# EAGLE schematic mosfet_ctl (EAGLE 9.6.0)

## Sheet 1 of 3
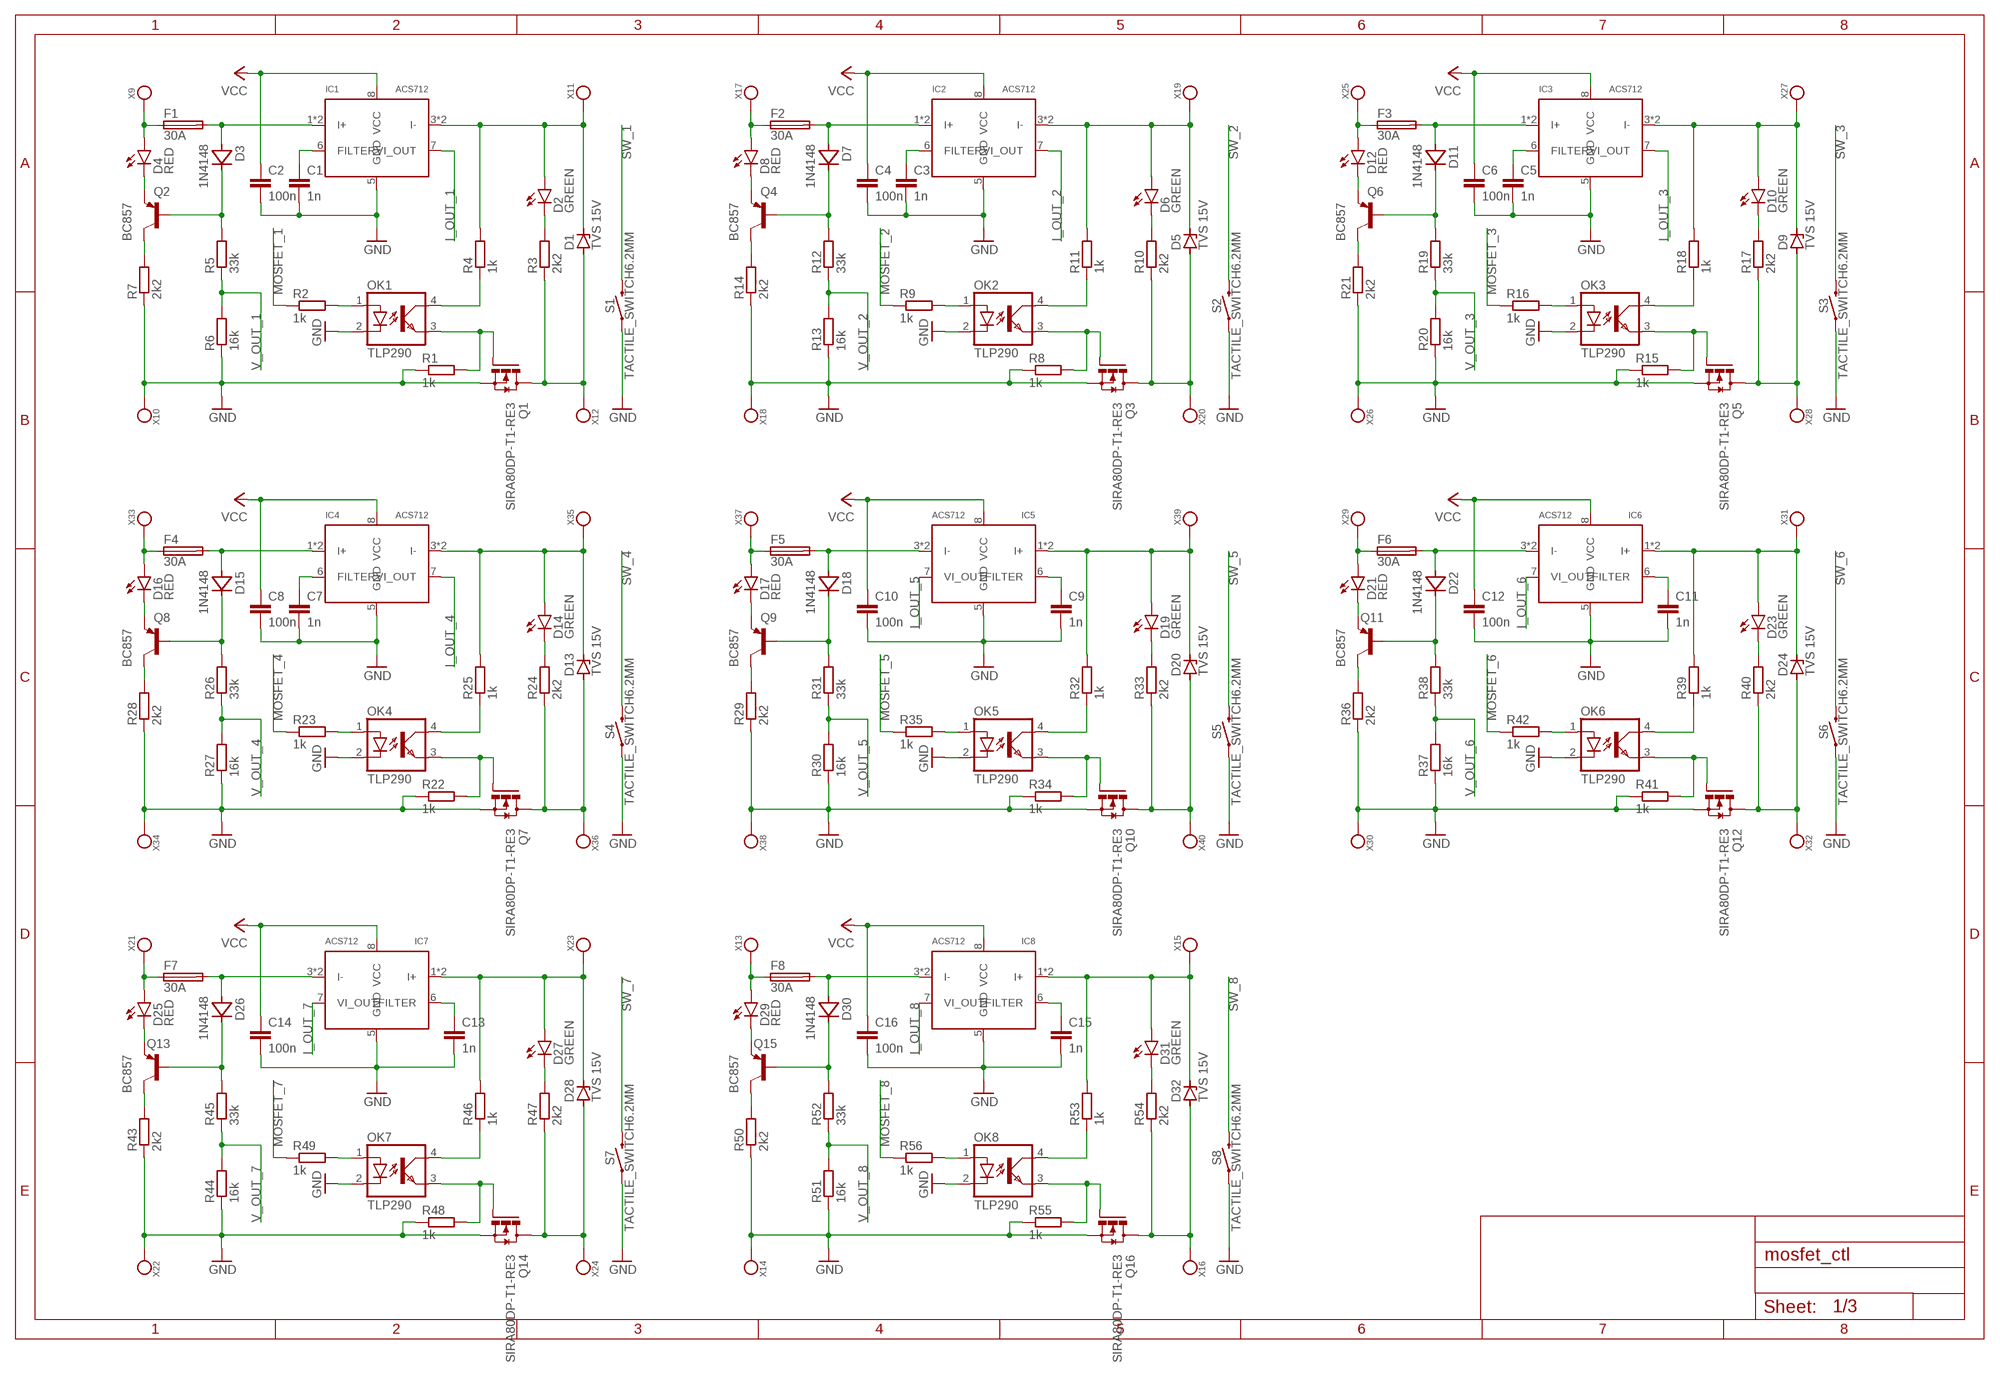
[diagram p0: schematic, sheet 1]

### Parts
C1  1n  CAPACITOR0805  [C0805]
C2  100n  CAPACITOR0805  [C0805]
C3  1n  CAPACITOR0805  [C0805]
C4  100n  CAPACITOR0805  [C0805]
C5  1n  CAPACITOR0805  [C0805]
C6  100n  CAPACITOR0805  [C0805]
C7  1n  CAPACITOR0805  [C0805]
C8  100n  CAPACITOR0805  [C0805]
C9  1n  CAPACITOR0805  [C0805]
C10  100n  CAPACITOR0805  [C0805]
C11  1n  CAPACITOR0805  [C0805]
C12  100n  CAPACITOR0805  [C0805]
C13  1n  CAPACITOR0805  [C0805]
C14  100n  CAPACITOR0805  [C0805]
C15  1n  CAPACITOR0805  [C0805]
C16  100n  CAPACITOR0805  [C0805]
D1  TVS 15V  DIODE_ZENERDO-214AC  [DO214AC]
D2  GREEN  LED1206  [CHIPLED_1206]
D3  1N4148  DIODESOD-123  [SOD123]
D4  RED  LED1206  [CHIPLED_1206]
D5  TVS 15V  DIODE_ZENERDO-214AC  [DO214AC]
D6  GREEN  LED1206  [CHIPLED_1206]
D7  1N4148  DIODESOD-123  [SOD123]
D8  RED  LED1206  [CHIPLED_1206]
D9  TVS 15V  DIODE_ZENERDO-214AC  [DO214AC]
D10  GREEN  LED1206  [CHIPLED_1206]
D11  1N4148  DIODESOD-123  [SOD123]
D12  RED  LED1206  [CHIPLED_1206]
D13  TVS 15V  DIODE_ZENERDO-214AC  [DO214AC]
D14  GREEN  LED1206  [CHIPLED_1206]
D15  1N4148  DIODESOD-123  [SOD123]
D16  RED  LED1206  [CHIPLED_1206]
D17  RED  LED1206  [CHIPLED_1206]
D18  1N4148  DIODESOD-123  [SOD123]
D19  GREEN  LED1206  [CHIPLED_1206]
D20  TVS 15V  DIODE_ZENERDO-214AC  [DO214AC]
D21  RED  LED1206  [CHIPLED_1206]
D22  1N4148  DIODESOD-123  [SOD123]
D23  GREEN  LED1206  [CHIPLED_1206]
D24  TVS 15V  DIODE_ZENERDO-214AC  [DO214AC]
D25  RED  LED1206  [CHIPLED_1206]
D26  1N4148  DIODESOD-123  [SOD123]
D27  GREEN  LED1206  [CHIPLED_1206]
D28  TVS 15V  DIODE_ZENERDO-214AC  [DO214AC]
D29  RED  LED1206  [CHIPLED_1206]
D30  1N4148  DIODESOD-123  [SOD123]
D31  GREEN  LED1206  [CHIPLED_1206]
D32  TVS 15V  DIODE_ZENERDO-214AC  [DO214AC]
F1  30A  KEYSTONE-3557-2  [KEYSTONE_3557-2]
F2  30A  KEYSTONE-3557-2  [KEYSTONE_3557-2]
F3  30A  KEYSTONE-3557-2  [KEYSTONE_3557-2]
F4  30A  KEYSTONE-3557-2  [KEYSTONE_3557-2]
F5  30A  KEYSTONE-3557-2  [KEYSTONE_3557-2]
F6  30A  KEYSTONE-3557-2  [KEYSTONE_3557-2]
F7  30A  KEYSTONE-3557-2  [KEYSTONE_3557-2]
F8  30A  KEYSTONE-3557-2  [KEYSTONE_3557-2]
IC1  ACS712  [SO08]
IC2  ACS712  [SO08]
IC3  ACS712  [SO08]
IC4  ACS712  [SO08]
IC5  ACS712  [SO08]
IC6  ACS712  [SO08]
IC7  ACS712  [SO08]
IC8  ACS712  [SO08]
OK1  TLP290  OPTOCOUPLERSO4  [SO04]
OK2  TLP290  OPTOCOUPLERSO4  [SO04]
OK3  TLP290  OPTOCOUPLERSO4  [SO04]
OK4  TLP290  OPTOCOUPLERSO4  [SO04]
OK5  TLP290  OPTOCOUPLERSO4  [SO04]
OK6  TLP290  OPTOCOUPLERSO4  [SO04]
OK7  TLP290  OPTOCOUPLERSO4  [SO04]
OK8  TLP290  OPTOCOUPLERSO4  [SO04]
Q1  SIRA80DP-T1-RE3  MOSFET_N_CHANNELPPAKSO8  [POWERPAK-SO8]
Q2  BC857  TRANSISTOR_PNPSOT23-CBE  [SOT23]
Q3  SIRA80DP-T1-RE3  MOSFET_N_CHANNELPPAKSO8  [POWERPAK-SO8]
Q4  BC857  TRANSISTOR_PNPSOT23-CBE  [SOT23]
Q5  SIRA80DP-T1-RE3  MOSFET_N_CHANNELPPAKSO8  [POWERPAK-SO8]
Q6  BC857  TRANSISTOR_PNPSOT23-CBE  [SOT23]
Q7  SIRA80DP-T1-RE3  MOSFET_N_CHANNELPPAKSO8  [POWERPAK-SO8]
Q8  BC857  TRANSISTOR_PNPSOT23-CBE  [SOT23]
Q9  BC857  TRANSISTOR_PNPSOT23-CBE  [SOT23]
Q10  SIRA80DP-T1-RE3  MOSFET_N_CHANNELPPAKSO8  [POWERPAK-SO8]
Q11  BC857  TRANSISTOR_PNPSOT23-CBE  [SOT23]
Q12  SIRA80DP-T1-RE3  MOSFET_N_CHANNELPPAKSO8  [POWERPAK-SO8]
Q13  BC857  TRANSISTOR_PNPSOT23-CBE  [SOT23]
Q14  SIRA80DP-T1-RE3  MOSFET_N_CHANNELPPAKSO8  [POWERPAK-SO8]
Q15  BC857  TRANSISTOR_PNPSOT23-CBE  [SOT23]
Q16  SIRA80DP-T1-RE3  MOSFET_N_CHANNELPPAKSO8  [POWERPAK-SO8]
R1  1k  RESISTOR0805  [R0805]
R2  1k  RESISTOR0805  [R0805]
R3  2k2  RESISTOR0805  [R0805]
R4  1k  RESISTOR0805  [R0805]
R5  33k  RESISTOR0805  [R0805]
R6  16k  RESISTOR0805  [R0805]
R7  2k2  RESISTOR0805  [R0805]
R8  1k  RESISTOR0805  [R0805]
R9  1k  RESISTOR0805  [R0805]
R10  2k2  RESISTOR0805  [R0805]
R11  1k  RESISTOR0805  [R0805]
R12  33k  RESISTOR0805  [R0805]
R13  16k  RESISTOR0805  [R0805]
R14  2k2  RESISTOR0805  [R0805]
R15  1k  RESISTOR0805  [R0805]
R16  1k  RESISTOR0805  [R0805]
R17  2k2  RESISTOR0805  [R0805]
R18  1k  RESISTOR0805  [R0805]
R19  33k  RESISTOR0805  [R0805]
R20  16k  RESISTOR0805  [R0805]
R21  2k2  RESISTOR0805  [R0805]
R22  1k  RESISTOR0805  [R0805]
R23  1k  RESISTOR0805  [R0805]
R24  2k2  RESISTOR0805  [R0805]
R25  1k  RESISTOR0805  [R0805]
R26  33k  RESISTOR0805  [R0805]
R27  16k  RESISTOR0805  [R0805]
R28  2k2  RESISTOR0805  [R0805]
R29  2k2  RESISTOR0805  [R0805]
R30  16k  RESISTOR0805  [R0805]
R31  33k  RESISTOR0805  [R0805]
R32  1k  RESISTOR0805  [R0805]
R33  2k2  RESISTOR0805  [R0805]
R34  1k  RESISTOR0805  [R0805]
R35  1k  RESISTOR0805  [R0805]
R36  2k2  RESISTOR0805  [R0805]
R37  16k  RESISTOR0805  [R0805]
R38  33k  RESISTOR0805  [R0805]
R39  1k  RESISTOR0805  [R0805]
R40  2k2  RESISTOR0805  [R0805]
R41  1k  RESISTOR0805  [R0805]
R42  1k  RESISTOR0805  [R0805]
R43  2k2  RESISTOR0805  [R0805]
R44  16k  RESISTOR0805  [R0805]
R45  33k  RESISTOR0805  [R0805]
R46  1k  RESISTOR0805  [R0805]
R47  2k2  RESISTOR0805  [R0805]
R48  1k  RESISTOR0805  [R0805]
R49  1k  RESISTOR0805  [R0805]
R50  2k2  RESISTOR0805  [R0805]
R51  16k  RESISTOR0805  [R0805]
R52  33k  RESISTOR0805  [R0805]
R53  1k  RESISTOR0805  [R0805]
R54  2k2  RESISTOR0805  [R0805]
R55  1k  RESISTOR0805  [R0805]
R56  1k  RESISTOR0805  [R0805]
S1  TACTILE_SWITCH6.2MM  [TACTILE_SWITCH_SMD_6.2MM]
S2  TACTILE_SWITCH6.2MM  [TACTILE_SWITCH_SMD_6.2MM]
S3  TACTILE_SWITCH6.2MM  [TACTILE_SWITCH_SMD_6.2MM]
S4  TACTILE_SWITCH6.2MM  [TACTILE_SWITCH_SMD_6.2MM]
S5  TACTILE_SWITCH6.2MM  [TACTILE_SWITCH_SMD_6.2MM]
S6  TACTILE_SWITCH6.2MM  [TACTILE_SWITCH_SMD_6.2MM]
S7  TACTILE_SWITCH6.2MM  [TACTILE_SWITCH_SMD_6.2MM]
S8  TACTILE_SWITCH6.2MM  [TACTILE_SWITCH_SMD_6.2MM]
X9  KEYSTONE_7800  [KEYSTONE_7800]
X10  KEYSTONE_7800  [KEYSTONE_7800]
X11  KEYSTONE_7800  [KEYSTONE_7800]
X12  KEYSTONE_7800  [KEYSTONE_7800]
X13  KEYSTONE_7800  [KEYSTONE_7800]
X14  KEYSTONE_7800  [KEYSTONE_7800]
X15  KEYSTONE_7800  [KEYSTONE_7800]
X16  KEYSTONE_7800  [KEYSTONE_7800]
X17  KEYSTONE_7800  [KEYSTONE_7800]
X18  KEYSTONE_7800  [KEYSTONE_7800]
X19  KEYSTONE_7800  [KEYSTONE_7800]
X20  KEYSTONE_7800  [KEYSTONE_7800]
X21  KEYSTONE_7800  [KEYSTONE_7800]
X22  KEYSTONE_7800  [KEYSTONE_7800]
X23  KEYSTONE_7800  [KEYSTONE_7800]
X24  KEYSTONE_7800  [KEYSTONE_7800]
X25  KEYSTONE_7800  [KEYSTONE_7800]
X26  KEYSTONE_7800  [KEYSTONE_7800]
X27  KEYSTONE_7800  [KEYSTONE_7800]
X28  KEYSTONE_7800  [KEYSTONE_7800]
X29  KEYSTONE_7800  [KEYSTONE_7800]
X30  KEYSTONE_7800  [KEYSTONE_7800]
X31  KEYSTONE_7800  [KEYSTONE_7800]
X32  KEYSTONE_7800  [KEYSTONE_7800]
X33  KEYSTONE_7800  [KEYSTONE_7800]
X34  KEYSTONE_7800  [KEYSTONE_7800]
X35  KEYSTONE_7800  [KEYSTONE_7800]
X36  KEYSTONE_7800  [KEYSTONE_7800]
X37  KEYSTONE_7800  [KEYSTONE_7800]
X38  KEYSTONE_7800  [KEYSTONE_7800]
X39  KEYSTONE_7800  [KEYSTONE_7800]
X40  KEYSTONE_7800  [KEYSTONE_7800]

### Nets
GND: C1.2 C2.2 C3.2 C4.2 C5.2 C6.2 C7.2 C8.2 C9.2 C10.2 C11.2 C12.2 C13.2 C14.2 C15.2 C16.2 IC1.5(GND) IC2.5(GND) IC3.5(GND) IC4.5(GND) IC5.5(GND) IC6.5(GND) IC7.5(GND) IC8.5(GND) OK1.2(C) OK2.2(C) OK3.2(C) OK4.2(C) OK5.2(C) OK6.2(C) OK7.2(C) OK8.2(C) Q1.1(S) Q1.2(S) Q3.1(S) Q3.2(S) Q5.1(S) Q5.2(S) Q7.1(S) Q7.2(S) Q10.1(S) Q10.2(S) Q12.1(S) Q12.2(S) Q14.1(S) Q14.2(S) Q16.1(S) Q16.2(S) R1.1 R6.1 R7.1 R8.1 R13.1 R14.1 R15.1 R20.1 R21.1 R22.1 R27.1 R28.1 R29.1 R30.1 R34.1 R36.1 R37.1 R41.1 R43.1 R44.1 R48.1 R50.1 R51.1 R55.1 S1.A1 S1.A2 S2.A1 S2.A2 S3.A1 S3.A2 S4.A1 S4.A2 S5.A1 S5.A2 S6.A1 S6.A2 S7.A1 S7.A2 S8.A1 S8.A2 X10.1(PIN) X10.2(PIN) X10.3(PIN) X10.4(PIN) X10.5(PIN) X10.6(PIN) X14.1(PIN) X14.2(PIN) X14.3(PIN) X14.4(PIN) X14.5(PIN) X14.6(PIN) X18.1(PIN) X18.2(PIN) X18.3(PIN) X18.4(PIN) X18.5(PIN) X18.6(PIN) X22.1(PIN) X22.2(PIN) X22.3(PIN) X22.4(PIN) X22.5(PIN) X22.6(PIN) X26.1(PIN) X26.2(PIN) X26.3(PIN) X26.4(PIN) X26.5(PIN) X26.6(PIN) X30.1(PIN) X30.2(PIN) X30.3(PIN) X30.4(PIN) X30.5(PIN) X30.6(PIN) X34.1(PIN) X34.2(PIN) X34.3(PIN) X34.4(PIN) X34.5(PIN) X34.6(PIN) X38.1(PIN) X38.2(PIN) X38.3(PIN) X38.4(PIN) X38.5(PIN) X38.6(PIN) ; also sheet 2,3
I_OUT_1: IC1.7(VI_OUT) ; also sheet 3
I_OUT_2: IC2.7(VI_OUT) ; also sheet 3
I_OUT_3: IC3.7(VI_OUT) ; also sheet 3
I_OUT_4: IC4.7(VI_OUT) ; also sheet 3
I_OUT_5: IC5.7(VI_OUT) ; also sheet 3
I_OUT_6: IC6.7(VI_OUT) ; also sheet 3
I_OUT_7: IC7.7(VI_OUT) ; also sheet 3
I_OUT_8: IC8.7(VI_OUT) ; also sheet 3
MOSFET_1: R2.1 ; also sheet 3
MOSFET_2: R9.1 ; also sheet 3
MOSFET_3: R16.1 ; also sheet 3
MOSFET_4: R23.1 ; also sheet 3
MOSFET_5: R35.1 ; also sheet 3
MOSFET_6: R42.1 ; also sheet 3
MOSFET_7: R49.1 ; also sheet 3
MOSFET_8: R56.1 ; also sheet 3
N$25: D4.A F1.1 F1.3 X9.1(PIN) X9.2(PIN) X9.3(PIN) X9.4(PIN) X9.5(PIN) X9.6(PIN)
N$26: D3.A F1.2 F1.4 IC1.1(I+) IC1.2(I+)
N$27: D4.C Q2.2(E)
N$28: D3.C Q2.3(B) R5.2
N$29: Q2.1(C) R7.2
N$30: C1.1 IC1.6(FILTER)
N$31: D2.C R3.2
N$32: OK1.1(A) R2.2
N$33: OK1.4(COL) R4.1
N$34: D1.C D2.A IC1.3(I-) IC1.4(I-) R4.2 X11.1(PIN) X11.2(PIN) X11.3(PIN) X11.4(PIN) X11.5(PIN) X11.6(PIN)
N$35: OK1.3(EMIT) Q1.3(G) Q1.4(G) R1.2
N$36: D1.A Q1.5(D) Q1.6(D) Q1.7(D) Q1.8(D) Q1.9(D) R3.1 X12.1(PIN) X12.2(PIN) X12.3(PIN) X12.4(PIN) X12.5(PIN) X12.6(PIN)
N$37: D29.A F8.1 F8.3 X13.1(PIN) X13.2(PIN) X13.3(PIN) X13.4(PIN) X13.5(PIN) X13.6(PIN)
N$38: D30.A F8.2 F8.4 IC8.3(I-) IC8.4(I-)
N$39: D29.C Q15.2(E)
N$40: D30.C Q15.3(B) R52.2
N$41: Q15.1(C) R50.2
N$42: C15.1 IC8.6(FILTER)
N$43: D31.C R54.2
N$44: OK8.1(A) R56.2
N$45: OK8.4(COL) R53.1
N$46: D31.A D32.C IC8.1(I+) IC8.2(I+) R53.2 X15.1(PIN) X15.2(PIN) X15.3(PIN) X15.4(PIN) X15.5(PIN) X15.6(PIN)
N$47: OK8.3(EMIT) Q16.3(G) Q16.4(G) R55.2
N$48: D32.A Q16.5(D) Q16.6(D) Q16.7(D) Q16.8(D) Q16.9(D) R54.1 X16.1(PIN) X16.2(PIN) X16.3(PIN) X16.4(PIN) X16.5(PIN) X16.6(PIN)
N$49: D8.A F2.1 F2.3 X17.1(PIN) X17.2(PIN) X17.3(PIN) X17.4(PIN) X17.5(PIN) X17.6(PIN)
N$50: D7.A F2.2 F2.4 IC2.1(I+) IC2.2(I+)
N$51: D8.C Q4.2(E)
N$52: D7.C Q4.3(B) R12.2
N$53: Q4.1(C) R14.2
N$54: C3.1 IC2.6(FILTER)
N$55: D6.C R10.2
N$56: OK2.1(A) R9.2
N$57: OK2.4(COL) R11.1
N$58: D5.C D6.A IC2.3(I-) IC2.4(I-) R11.2 X19.1(PIN) X19.2(PIN) X19.3(PIN) X19.4(PIN) X19.5(PIN) X19.6(PIN)
N$59: OK2.3(EMIT) Q3.3(G) Q3.4(G) R8.2
N$60: D5.A Q3.5(D) Q3.6(D) Q3.7(D) Q3.8(D) Q3.9(D) R10.1 X20.1(PIN) X20.2(PIN) X20.3(PIN) X20.4(PIN) X20.5(PIN) X20.6(PIN)
N$61: D25.A F7.1 F7.3 X21.1(PIN) X21.2(PIN) X21.3(PIN) X21.4(PIN) X21.5(PIN) X21.6(PIN)
N$62: D26.A F7.2 F7.4 IC7.3(I-) IC7.4(I-)
N$63: D25.C Q13.2(E)
N$64: D26.C Q13.3(B) R45.2
N$65: Q13.1(C) R43.2
N$66: C13.1 IC7.6(FILTER)
N$67: D27.C R47.2
N$68: OK7.1(A) R49.2
N$69: OK7.4(COL) R46.1
N$70: D27.A D28.C IC7.1(I+) IC7.2(I+) R46.2 X23.1(PIN) X23.2(PIN) X23.3(PIN) X23.4(PIN) X23.5(PIN) X23.6(PIN)
N$71: OK7.3(EMIT) Q14.3(G) Q14.4(G) R48.2
N$72: D28.A Q14.5(D) Q14.6(D) Q14.7(D) Q14.8(D) Q14.9(D) R47.1 X24.1(PIN) X24.2(PIN) X24.3(PIN) X24.4(PIN) X24.5(PIN) X24.6(PIN)
N$73: D12.A F3.1 F3.3 X25.1(PIN) X25.2(PIN) X25.3(PIN) X25.4(PIN) X25.5(PIN) X25.6(PIN)
N$74: D11.A F3.2 F3.4 IC3.1(I+) IC3.2(I+)
N$75: D12.C Q6.2(E)
N$76: D11.C Q6.3(B) R19.2
N$77: Q6.1(C) R21.2
N$78: C5.1 IC3.6(FILTER)
N$79: D10.C R17.2
N$80: OK3.1(A) R16.2
N$81: OK3.4(COL) R18.1
N$82: D9.C D10.A IC3.3(I-) IC3.4(I-) R18.2 X27.1(PIN) X27.2(PIN) X27.3(PIN) X27.4(PIN) X27.5(PIN) X27.6(PIN)
N$83: OK3.3(EMIT) Q5.3(G) Q5.4(G) R15.2
N$84: D9.A Q5.5(D) Q5.6(D) Q5.7(D) Q5.8(D) Q5.9(D) R17.1 X28.1(PIN) X28.2(PIN) X28.3(PIN) X28.4(PIN) X28.5(PIN) X28.6(PIN)
N$85: D21.A F6.1 F6.3 X29.1(PIN) X29.2(PIN) X29.3(PIN) X29.4(PIN) X29.5(PIN) X29.6(PIN)
N$86: D22.A F6.2 F6.4 IC6.3(I-) IC6.4(I-)
N$87: D21.C Q11.2(E)
N$88: D22.C Q11.3(B) R38.2
N$89: Q11.1(C) R36.2
N$90: C11.1 IC6.6(FILTER)
N$91: D23.C R40.2
N$92: OK6.1(A) R42.2
N$93: OK6.4(COL) R39.1
N$94: D23.A D24.C IC6.1(I+) IC6.2(I+) R39.2 X31.1(PIN) X31.2(PIN) X31.3(PIN) X31.4(PIN) X31.5(PIN) X31.6(PIN)
N$95: OK6.3(EMIT) Q12.3(G) Q12.4(G) R41.2
N$96: D24.A Q12.5(D) Q12.6(D) Q12.7(D) Q12.8(D) Q12.9(D) R40.1 X32.1(PIN) X32.2(PIN) X32.3(PIN) X32.4(PIN) X32.5(PIN) X32.6(PIN)
N$97: D16.A F4.1 F4.3 X33.1(PIN) X33.2(PIN) X33.3(PIN) X33.4(PIN) X33.5(PIN) X33.6(PIN)
N$98: D15.A F4.2 F4.4 IC4.1(I+) IC4.2(I+)
N$99: D16.C Q8.2(E)
N$100: D15.C Q8.3(B) R26.2
N$101: Q8.1(C) R28.2
N$102: C7.1 IC4.6(FILTER)
N$103: D14.C R24.2
N$104: OK4.1(A) R23.2
N$105: OK4.4(COL) R25.1
N$106: D13.C D14.A IC4.3(I-) IC4.4(I-) R25.2 X35.1(PIN) X35.2(PIN) X35.3(PIN) X35.4(PIN) X35.5(PIN) X35.6(PIN)
N$107: OK4.3(EMIT) Q7.3(G) Q7.4(G) R22.2
N$108: D13.A Q7.5(D) Q7.6(D) Q7.7(D) Q7.8(D) Q7.9(D) R24.1 X36.1(PIN) X36.2(PIN) X36.3(PIN) X36.4(PIN) X36.5(PIN) X36.6(PIN)
N$109: D17.A F5.1 F5.3 X37.1(PIN) X37.2(PIN) X37.3(PIN) X37.4(PIN) X37.5(PIN) X37.6(PIN)
N$110: D18.A F5.2 F5.4 IC5.3(I-) IC5.4(I-)
N$111: D17.C Q9.2(E)
N$112: D18.C Q9.3(B) R31.2
N$113: Q9.1(C) R29.2
N$114: C9.1 IC5.6(FILTER)
N$115: D19.C R33.2
N$116: OK5.1(A) R35.2
N$117: OK5.4(COL) R32.1
N$118: D19.A D20.C IC5.1(I+) IC5.2(I+) R32.2 X39.1(PIN) X39.2(PIN) X39.3(PIN) X39.4(PIN) X39.5(PIN) X39.6(PIN)
N$119: OK5.3(EMIT) Q10.3(G) Q10.4(G) R34.2
N$120: D20.A Q10.5(D) Q10.6(D) Q10.7(D) Q10.8(D) Q10.9(D) R33.1 X40.1(PIN) X40.2(PIN) X40.3(PIN) X40.4(PIN) X40.5(PIN) X40.6(PIN)
SW_1: S1.B1 S1.B2 ; also sheet 3
SW_2: S2.B1 S2.B2 ; also sheet 3
SW_3: S3.B1 S3.B2 ; also sheet 3
SW_4: S4.B1 S4.B2 ; also sheet 3
SW_5: S5.B1 S5.B2 ; also sheet 3
SW_6: S6.B1 S6.B2 ; also sheet 3
SW_7: S7.B1 S7.B2 ; also sheet 3
SW_8: S8.B1 S8.B2 ; also sheet 3
V_OUT_1: R5.1 R6.2 ; also sheet 3
V_OUT_2: R12.1 R13.2 ; also sheet 3
V_OUT_3: R19.1 R20.2 ; also sheet 3
V_OUT_4: R26.1 R27.2 ; also sheet 3
V_OUT_5: R30.2 R31.1 ; also sheet 3
V_OUT_6: R37.2 R38.1 ; also sheet 3
V_OUT_7: R44.2 R45.1 ; also sheet 3
V_OUT_8: R51.2 R52.1 ; also sheet 3
VCC: C2.1 C4.1 C6.1 C8.1 C10.1 C12.1 C14.1 C16.1 IC1.8(VCC) IC2.8(VCC) IC3.8(VCC) IC4.8(VCC) IC5.8(VCC) IC6.8(VCC) IC7.8(VCC) IC8.8(VCC) ; also sheet 2,3

## Sheet 2 of 3
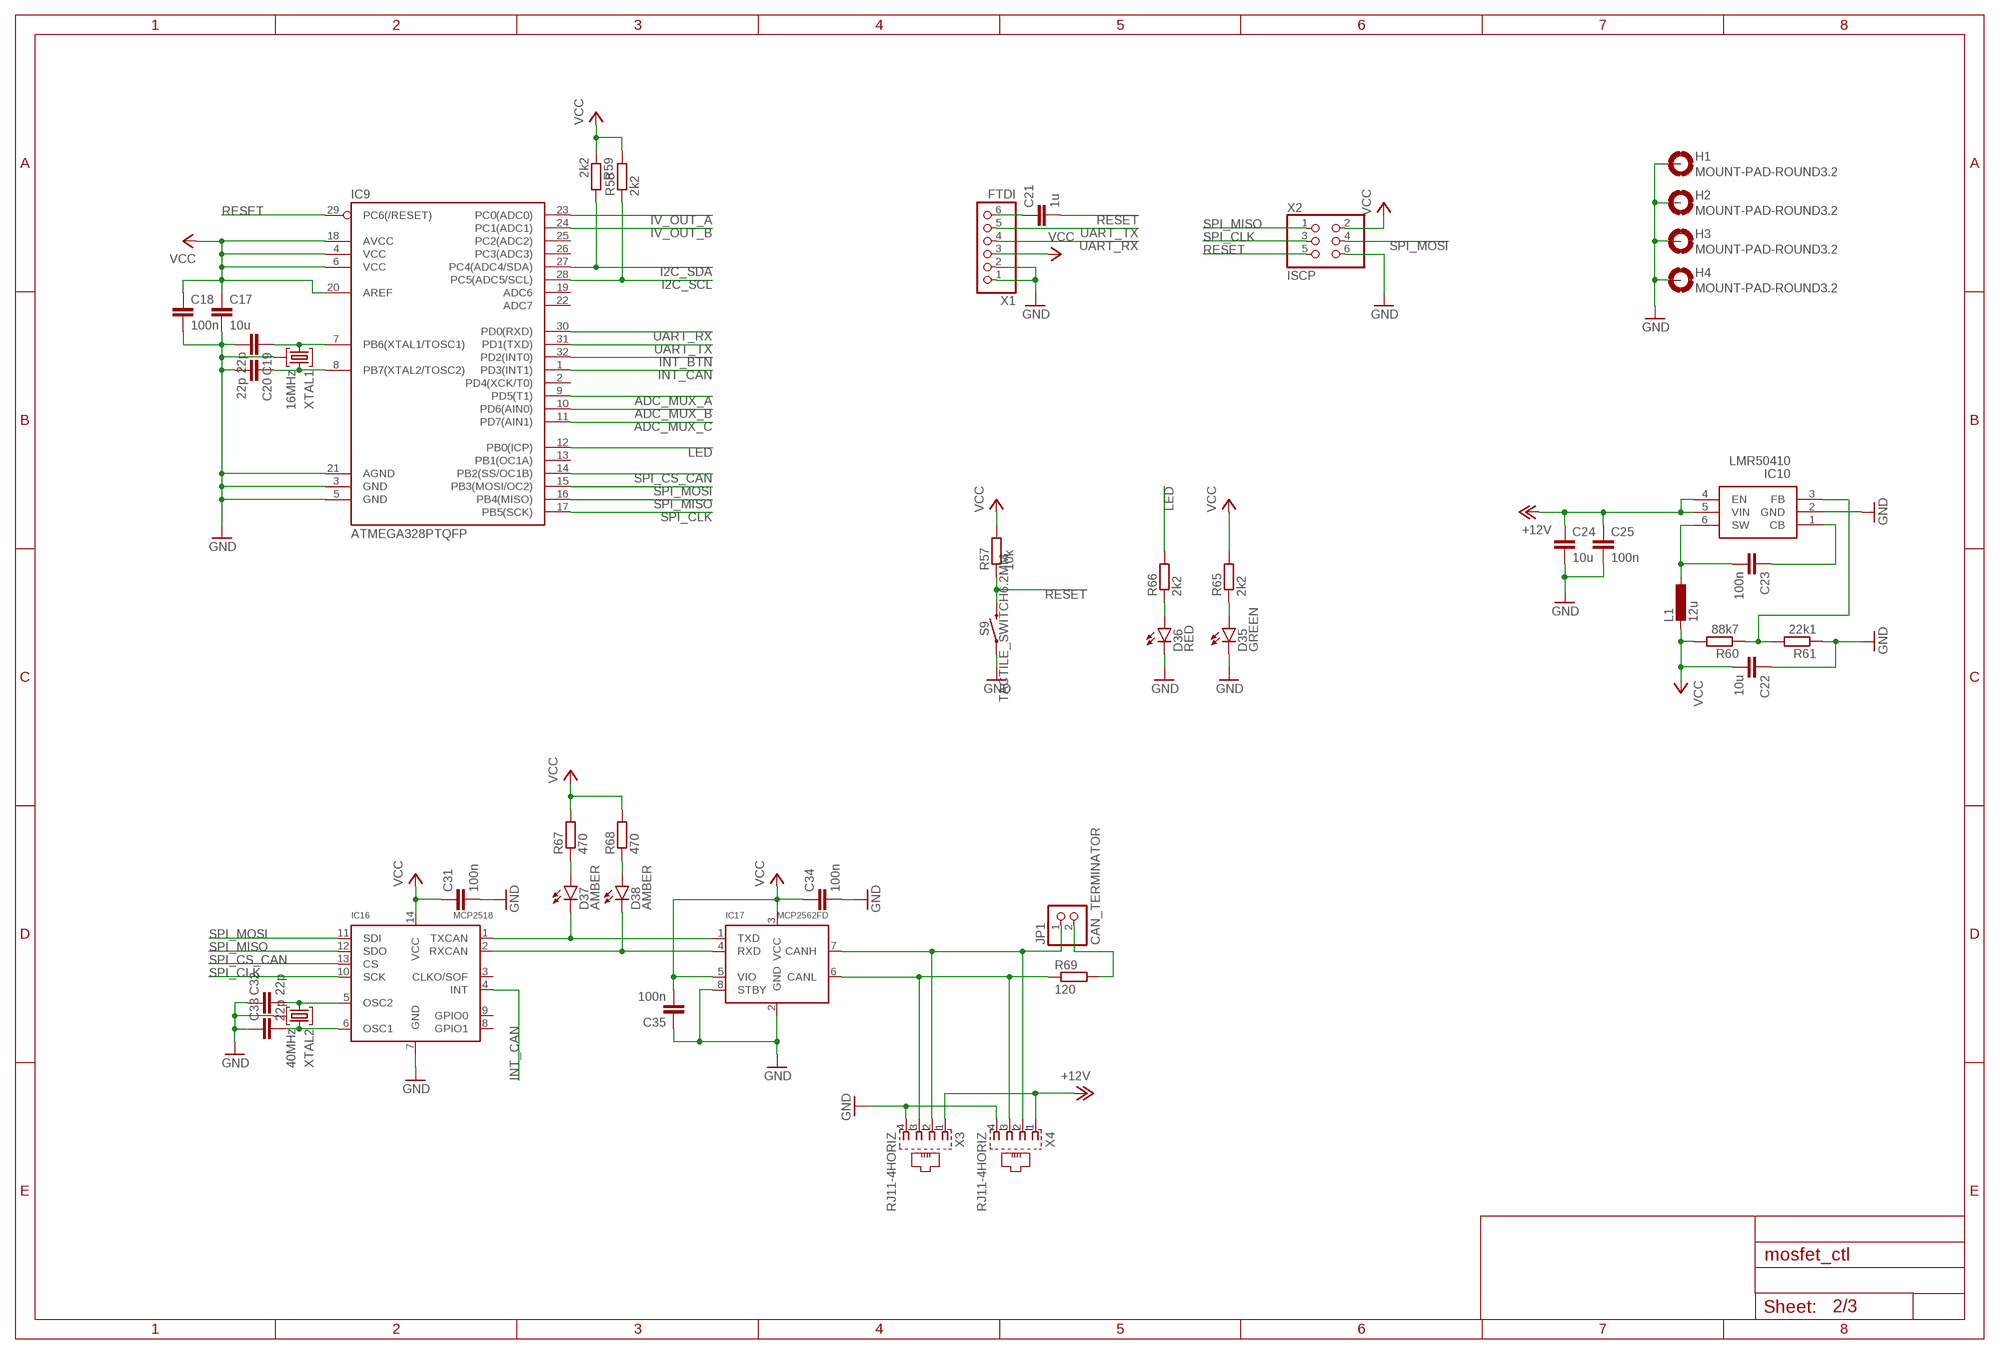
[diagram p1: schematic, sheet 2]

### Parts
C17  10u  CAPACITOR1206  [C1206]
C18  100n  CAPACITOR0805  [C0805]
C19  22p  CAPACITOR0805  [C0805]
C20  22p  CAPACITOR0805  [C0805]
C21  1u  CAPACITOR0805  [C0805]
C22  10u  CAPACITOR1206  [C1206]
C23  100n  CAPACITOR0805  [C0805]
C24  10u  CAPACITOR1206  [C1206]
C25  100n  CAPACITOR0805  [C0805]
C31  100n  CAPACITOR0805  [C0805]
C32  22p  CAPACITOR0805  [C0805]
C33  22p  CAPACITOR0805  [C0805]
C34  100n  CAPACITOR0805  [C0805]
C35  100n  CAPACITOR0805  [C0805]
D35  GREEN  LED1206  [CHIPLED_1206]
D36  RED  LED1206  [CHIPLED_1206]
D37  AMBER  LED1206  [CHIPLED_1206]
D38  AMBER  LED1206  [CHIPLED_1206]
H1  MOUNT-PAD-ROUND3.2  [3,2-PAD]
H2  MOUNT-PAD-ROUND3.2  [3,2-PAD]
H3  MOUNT-PAD-ROUND3.2  [3,2-PAD]
H4  MOUNT-PAD-ROUND3.2  [3,2-PAD]
IC9  ATMEGA328PTQFP  [TQFP32_0.8MM_7X7MM]
IC10  LMR50410  [SOT23-6]
IC16  MCP2518  MCP2518FDSO14  [SO14]
IC17  MCP2562FD  MCP2562FDSO08  [SO08]
JP1  CAN_TERMINATOR  PINHD-1X2  [1X02]
L1  12u  INDUCTOR7.3MM  [L_7.3MM]
R57  10k  RESISTOR0805  [R0805]
R58  2k2  RESISTOR0805  [R0805]
R59  2k2  RESISTOR0805  [R0805]
R60  88k7  RESISTOR0805  [R0805]
R61  22k1  RESISTOR0805  [R0805]
R65  2k2  RESISTOR0805  [R0805]
R66  2k2  RESISTOR0805  [R0805]
R67  470  RESISTOR0805  [R0805]
R68  470  RESISTOR0805  [R0805]
R69  120  RESISTOR0805  [R0805]
S9  TACTILE_SWITCH6.2MM  [TACTILE_SWITCH_SMD_6.2MM]
X1  FTDI  PINHD-1X6  [1X06]
X2  ISCP  PINHD-2X3  [2X03]
X3  RJ11-4HORIZ  [RJ11-4_HORIZ]
X4  RJ11-4HORIZ  [RJ11-4_HORIZ]
XTAL1  16MHz  CRYSTAL_GND5X3.2  [XTAL_5.0X3.2_4]
XTAL2  40MHz  CRYSTAL_GND5X3.2  [XTAL_5.0X3.2_4]

### Nets
+12V: C24.1 C25.1 IC10.4(EN) IC10.5(VIN) X3.1 X4.1
ADC_MUX_A: IC9.9(PD5(T1)) ; also sheet 3
ADC_MUX_B: IC9.10(PD6(AIN0)) ; also sheet 3
ADC_MUX_C: IC9.11(PD7(AIN1)) ; also sheet 3
GND: C17.2 C18.2 C19.2 C20.2 C22.1 C24.2 C25.2 C31.2 C32.1 C33.1 C34.2 C35.1 D35.C D36.C H1.B3,2(MOUNT) H1.P$1(MOUNT) H1.P$2(MOUNT) H1.P$3(MOUNT) H1.P$4(MOUNT) H1.P$5(MOUNT) H1.P$6(MOUNT) H1.P$7(MOUNT) H1.P$8(MOUNT) H2.B3,2(MOUNT) H2.P$1(MOUNT) H2.P$2(MOUNT) H2.P$3(MOUNT) H2.P$4(MOUNT) H2.P$5(MOUNT) H2.P$6(MOUNT) H2.P$7(MOUNT) H2.P$8(MOUNT) H3.B3,2(MOUNT) H3.P$1(MOUNT) H3.P$2(MOUNT) H3.P$3(MOUNT) H3.P$4(MOUNT) H3.P$5(MOUNT) H3.P$6(MOUNT) H3.P$7(MOUNT) H3.P$8(MOUNT) H4.B3,2(MOUNT) H4.P$1(MOUNT) H4.P$2(MOUNT) H4.P$3(MOUNT) H4.P$4(MOUNT) H4.P$5(MOUNT) H4.P$6(MOUNT) H4.P$7(MOUNT) H4.P$8(MOUNT) IC9.3(GND) IC9.5(GND) IC9.21(AGND) IC10.2(GND) IC16.7(GND) IC17.2(GND) IC17.8(STBY) R61.1 S9.A1 S9.A2 X1.1 X1.2 X2.6 X3.4 X4.4 XTAL1.2 XTAL1.4 XTAL2.2 XTAL2.4 ; also sheet 1,3
I2C_SCL: IC9.28(PC5(ADC5/SCL)) R58.1 ; also sheet 3
I2C_SDA: IC9.27(PC4(ADC4/SDA)) R59.2 ; also sheet 3
INT_BTN: IC9.32(PD2(INT0)) ; also sheet 3
INT_CAN: IC9.1(PD3(INT1)) IC16.4(INT)
IV_OUT_A: IC9.23(PC0(ADC0)) ; also sheet 3
IV_OUT_B: IC9.24(PC1(ADC1)) ; also sheet 3
LED: IC9.12(PB0(ICP)) R66.2
N$1: D36.A R66.1
N$3: C19.1 IC9.7(PB6(XTAL1/TOSC1)) XTAL1.1
N$4: C20.1 IC9.8(PB7(XTAL2/TOSC2)) XTAL1.3
N$5: D35.A R65.1
N$6: C21.1 X1.6
N$16: IC17.6(CANL) R69.1 X3.3 X4.3
N$17: IC17.7(CANH) JP1.1 X3.2 X4.2
N$18: D37.C IC16.1(TXCAN) IC17.1(TXD)
N$19: D38.C IC16.2(RXCAN) IC17.4(RXD)
N$20: C32.2 IC16.5(OSC2) XTAL2.1
N$21: C33.2 IC16.6(OSC1) XTAL2.3
N$22: D37.A R67.1
N$23: D38.A R68.1
N$24: JP1.2 R69.2
N$125: C23.2 IC10.6(SW) L1.1
N$126: C23.1 IC10.1(CB)
N$127: IC10.3(FB) R60.1 R61.2
RESET: C21.2 IC9.29(PC6(/RESET)) R57.1 S9.B1 S9.B2 X2.5 ; also sheet 3
SPI_CLK: IC9.17(PB5(SCK)) IC16.10(SCK) X2.3
SPI_CS_CAN: IC9.14(PB2(SS/OC1B)) IC16.13(CS)
SPI_MISO: IC9.16(PB4(MISO)) IC16.12(SDO) X2.1
SPI_MOSI: IC9.15(PB3(MOSI/OC2)) IC16.11(SDI) X2.4
UART_RX: IC9.30(PD0(RXD)) X1.4
UART_TX: IC9.31(PD1(TXD)) X1.5
VCC: C17.1 C18.1 C22.2 C31.1 C34.1 C35.2 IC9.4(VCC) IC9.6(VCC) IC9.18(AVCC) IC9.20(AREF) IC16.14(VCC) IC17.3(VCC) IC17.5(VIO) L1.2 R57.2 R58.2 R59.1 R60.2 R65.2 R67.2 R68.2 X1.3 X2.2 ; also sheet 1,3
Unconnected: IC9.2(PD4(XCK/T0)) IC9.13(PB1(OC1A)) IC9.19(ADC6) IC9.22(ADC7) IC9.25(PC2(ADC2)) IC9.26(PC3(ADC3)) IC16.3(CLKO/SOF) IC16.8(GPIO1) IC16.9(GPIO0)

## Sheet 3 of 3
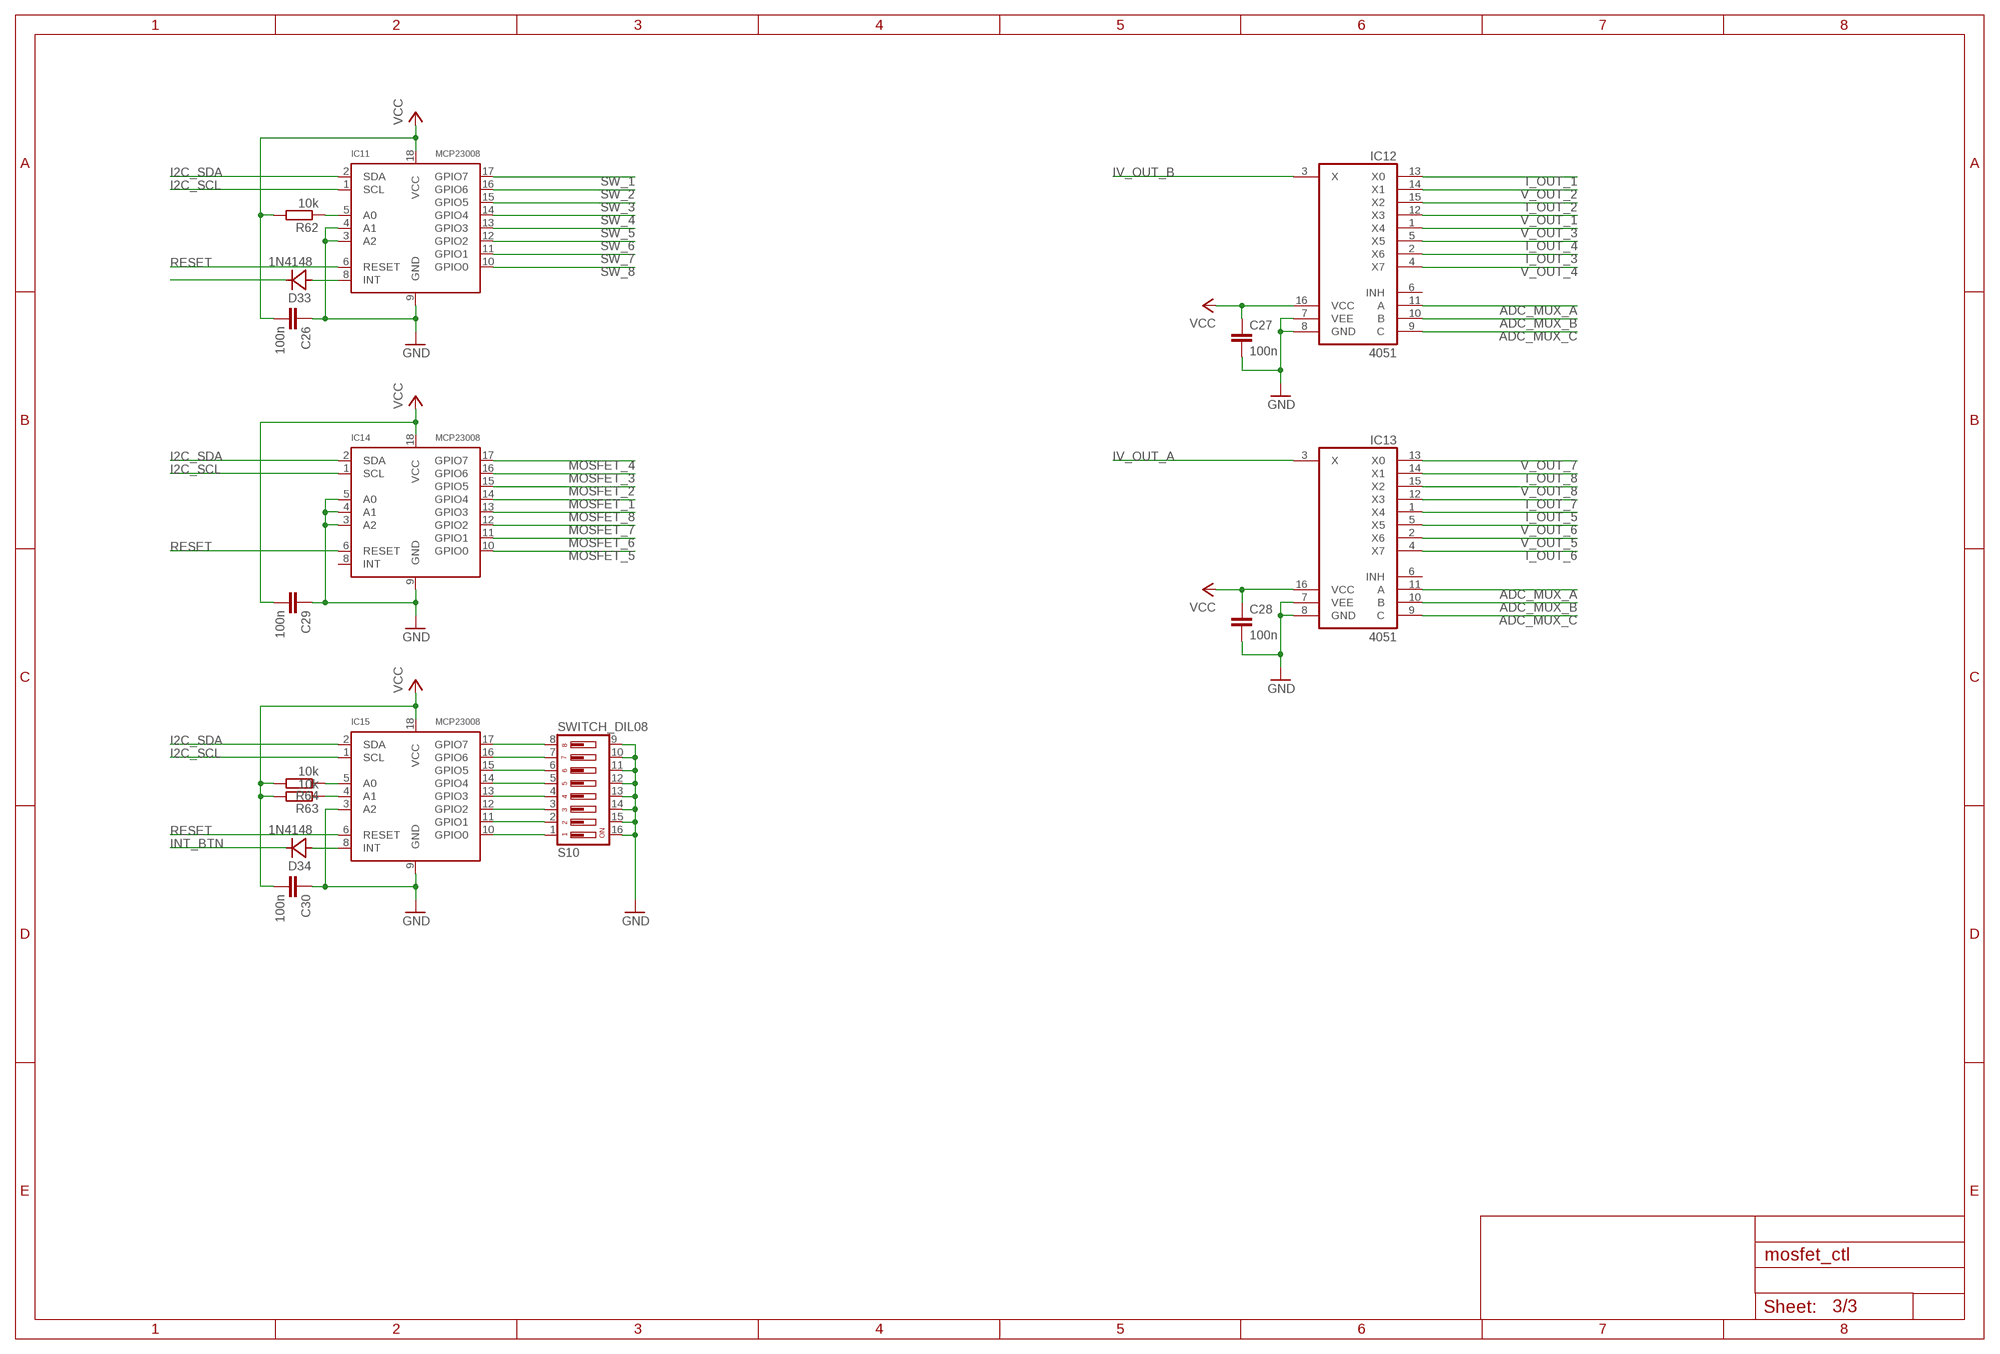
[diagram p2: schematic, sheet 3]

### Parts
C26  100n  CAPACITOR0805  [C0805]
C27  100n  CAPACITOR0805  [C0805]
C28  100n  CAPACITOR0805  [C0805]
C29  100n  CAPACITOR0805  [C0805]
C30  100n  CAPACITOR0805  [C0805]
D33  1N4148  DIODESOD-123  [SOD123]
D34  1N4148  DIODESOD-123  [SOD123]
IC11  MCP23008  MCP23008SO18W  [SO18W]
IC12  4051  4051SO16  [SO16]
IC13  4051  4051SO16  [SO16]
IC14  MCP23008  MCP23008SO18W  [SO18W]
IC15  MCP23008  MCP23008SO18W  [SO18W]
R62  10k  RESISTOR0805  [R0805]
R63  10k  RESISTOR0805  [R0805]
R64  10k  RESISTOR0805  [R0805]
S10  SWITCH_DIL08  [CTS-219-08]

### Nets
ADC_MUX_A: IC12.11(A) IC13.11(A) ; also sheet 2
ADC_MUX_B: IC12.10(B) IC13.10(B) ; also sheet 2
ADC_MUX_C: IC12.9(C) IC13.9(C) ; also sheet 2
GND: C26.1 C27.2 C28.2 C29.1 C30.1 IC11.3(A2) IC11.4(A1) IC11.9(GND) IC12.7(VEE) IC12.8(GND) IC13.7(VEE) IC13.8(GND) IC14.3(A2) IC14.4(A1) IC14.5(A0) IC14.9(GND) IC15.3(A2) IC15.9(GND) S10.9 S10.10 S10.11 S10.12 S10.13 S10.14 S10.15 S10.16 ; also sheet 1,2
I2C_SCL: IC11.1(SCL) IC14.1(SCL) IC15.1(SCL) ; also sheet 2
I2C_SDA: IC11.2(SDA) IC14.2(SDA) IC15.2(SDA) ; also sheet 2
I_OUT_1: IC12.13(X0) ; also sheet 1
I_OUT_2: IC12.15(X2) ; also sheet 1
I_OUT_3: IC12.2(X6) ; also sheet 1
I_OUT_4: IC12.5(X5) ; also sheet 1
I_OUT_5: IC13.1(X4) ; also sheet 1
I_OUT_6: IC13.4(X7) ; also sheet 1
I_OUT_7: IC13.12(X3) ; also sheet 1
I_OUT_8: IC13.14(X1) ; also sheet 1
INT_BTN: D33.C D34.C ; also sheet 2
IV_OUT_A: IC13.3(X) ; also sheet 2
IV_OUT_B: IC12.3(X) ; also sheet 2
MOSFET_1: IC14.14(GPIO4) ; also sheet 1
MOSFET_2: IC14.15(GPIO5) ; also sheet 1
MOSFET_3: IC14.16(GPIO6) ; also sheet 1
MOSFET_4: IC14.17(GPIO7) ; also sheet 1
MOSFET_5: IC14.10(GPIO0) ; also sheet 1
MOSFET_6: IC14.11(GPIO1) ; also sheet 1
MOSFET_7: IC14.12(GPIO2) ; also sheet 1
MOSFET_8: IC14.13(GPIO3) ; also sheet 1
N$2: IC11.5(A0) R62.1
N$7: IC15.5(A0) R64.1
N$8: IC15.4(A1) R63.1
N$9: IC15.10(GPIO0) S10.1
N$10: IC15.11(GPIO1) S10.2
N$11: IC15.12(GPIO2) S10.3
N$12: IC15.13(GPIO3) S10.4
N$13: IC15.14(GPIO4) S10.5
N$14: IC15.15(GPIO5) S10.6
N$15: IC15.16(GPIO6) S10.7
N$121: IC15.17(GPIO7) S10.8
N$122: D33.A IC11.8(INT)
N$123: D34.A IC15.8(INT)
RESET: IC11.6(RESET) IC14.6(RESET) IC15.6(RESET) ; also sheet 2
SW_1: IC11.17(GPIO7) ; also sheet 1
SW_2: IC11.16(GPIO6) ; also sheet 1
SW_3: IC11.15(GPIO5) ; also sheet 1
SW_4: IC11.14(GPIO4) ; also sheet 1
SW_5: IC11.13(GPIO3) ; also sheet 1
SW_6: IC11.12(GPIO2) ; also sheet 1
SW_7: IC11.11(GPIO1) ; also sheet 1
SW_8: IC11.10(GPIO0) ; also sheet 1
V_OUT_1: IC12.12(X3) ; also sheet 1
V_OUT_2: IC12.14(X1) ; also sheet 1
V_OUT_3: IC12.1(X4) ; also sheet 1
V_OUT_4: IC12.4(X7) ; also sheet 1
V_OUT_5: IC13.2(X6) ; also sheet 1
V_OUT_6: IC13.5(X5) ; also sheet 1
V_OUT_7: IC13.13(X0) ; also sheet 1
V_OUT_8: IC13.15(X2) ; also sheet 1
VCC: C26.2 C27.1 C28.1 C29.2 C30.2 IC11.18(VCC) IC12.16(VCC) IC13.16(VCC) IC14.18(VCC) IC15.18(VCC) R62.2 R63.2 R64.2 ; also sheet 1,2
Unconnected: IC12.6(INH) IC13.6(INH) IC14.8(INT)

## Library data of the parts
C1-C35 = SMD:CAPACITOR
D1 D5 D9 D13 D20 D24 D28 D32 = SMD:DIODE_ZENER
D2 D4 D6 D8 D10 D12 D14 D16 D17 D19 D21 D23 D25 D27 D29 D31 D35-D38 = SMD:LED
D3 D7 D11 D15 D18 D22 D26 D30 D33 D34 = SMD:DIODE
F1-F8 = THT:KEYSTONE-3557-2
H1-H4 = THT:MOUNT-PAD-ROUND: MOUNTING PAD, round
IC1-IC8 = SMD:ACS712
IC9 = SMD:ATMEGA328P
IC10 = SMD:LMR50410
IC11 IC14 IC15 = SMD:MCP23008
IC12 IC13 = SMD:4051
IC16 = SMD:MCP2518FD
IC17 = SMD:MCP2562FD
JP1 = THT:PINHD-1X2: PIN HEADER
L1 = SMD:INDUCTOR
OK1-OK8 = SMD:OPTOCOUPLER
Q1 Q3 Q5 Q7 Q10 Q12 Q14 Q16 = SMD:MOSFET_N_CHANNEL
Q2 Q4 Q6 Q8 Q9 Q11 Q13 Q15 = SMD:TRANSISTOR_PNP
R1-R69 = SMD:RESISTOR
S1-S9 = SMD:TACTILE_SWITCH
S10 = SMD:SWITCH_DIL08: Surface Mount DIP Switch Series 219 SMT CTS Electronic Components Sourc: www.ctscorp.com; OC_FARNELL: unknown; OC_NEWARK: unknown
X1 = THT:PINHD-1X6: PIN HEADER
X2 = THT:PINHD-2X3: PIN HEADER
X3 X4 = THT:RJ11-4
X9-X40 = THT:KEYSTONE_7800
XTAL1 XTAL2 = SMD:CRYSTAL_GND